# EAGLE design emontx-shield-v1 (EAGLE 6.2)
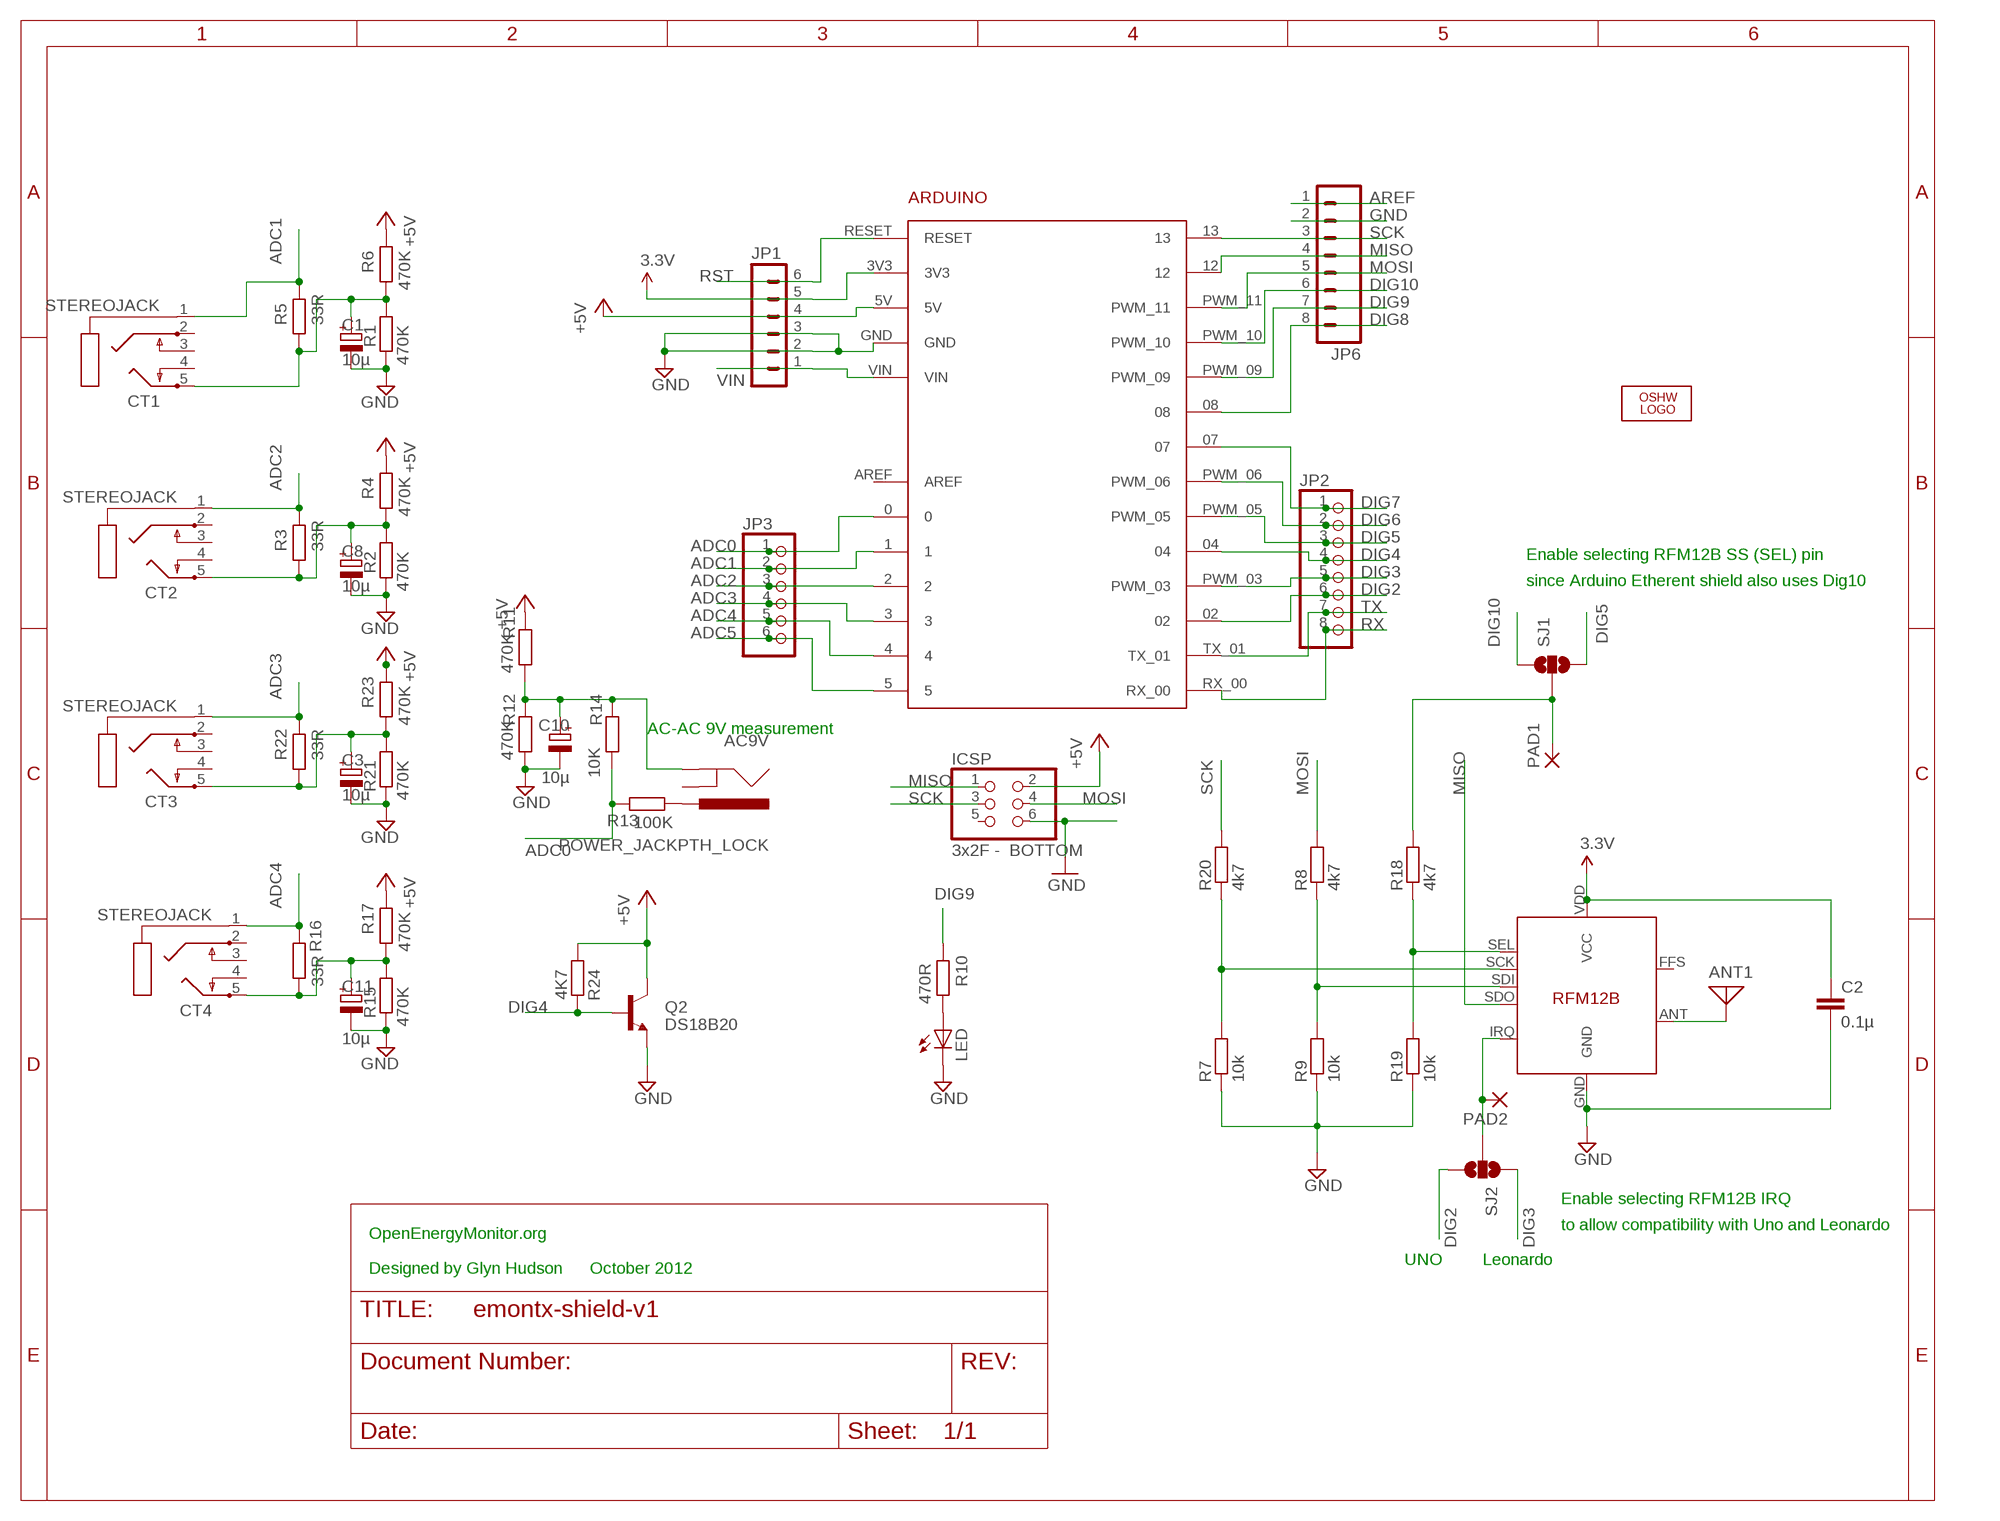
[diagram p0: schematic, sheet 1]

## Parts
AC9V  POWER_JACKPTH_LOCK  [POWER_JACK_PTH_LOCK]
ANT1  ANTENNA  [PAD-01]
ARDUINO1  ARDUINO2  [ARDUINO2]
C1  10µ  CPOL-EUE1.8-4  [E1,8-4]
C2  0.1µ  CAPPTH  [CAP-PTH-SMALL]
C3  10µ  CPOL-EUE1.8-4  [E1,8-4]
C8  10µ  CPOL-EUE1.8-4  [E1,8-4]
C10  10µ  CPOL-EUE1.8-4  [E1,8-4]
C11  10µ  CPOL-EUE1.8-4  [E1,8-4]
CT1  STEREOJACK  [STX3100]
CT2  STEREOJACK  [STX3100]
CT3  STEREOJACK  [STX3100]
CT4  STEREOJACK  [STX3100]
ICSP  3x2F - BOTTOM  PINHD-2X3  [2X03]
JP1  JEELABS_MA06-1  [JEELABS_MA06-1]
JP2  PINHD-1X8  [1X08]
JP3  PINHD-1X6  [1X06]
JP6  SPARKFUN_M08  [SPARKFUN_1X08]
LED  LED3MM  [LED3MM]
LOGO1  OSHW_LOGO_10MILX0200-NT  [OSHW_10X200_NOTEXT]
PAD1  JEELABS_1,6/0,8  [JEELABS_1,6/0,8]
PAD2  JEELABS_1,6/0,8  [JEELABS_1,6/0,8]
Q2  DS18B20  TRANSISTOR_NPNTO92  [TO-92]
R1  470K  R-EU_0204/7  [0204/7]
R2  470K  R-EU_0204/7  [0204/7]
R3  33R  R-EU_0204/7  [0204/7]
R4  470K  R-EU_0204/7  [0204/7]
R5  33R  R-EU_0204/7  [0204/7]
R6  470K  R-EU_0204/7  [0204/7]
R7  10k  RESISTOR_R-EU_0204/7  [RESISTOR_0204/7]
R8  4k7  RESISTOR_R-EU_0204/7  [RESISTOR_0204/7]
R9  10k  RESISTOR_R-EU_0204/7  [RESISTOR_0204/7]
R10  470R  R-EU_0204/7  [0204/7]
R11  470K  R-EU_0204/7  [0204/7]
R12  470K  R-EU_0204/7  [0204/7]
R13  100K  R-EU_0204/7  [0204/7]
R14  10K  R-EU_0204/7  [0204/7]
R15  470K  R-EU_0204/7  [0204/7]
R16  33R  R-EU_0204/7  [0204/7]
R17  470K  R-EU_0204/7  [0204/7]
R18  4k7  RESISTOR_R-EU_0204/7  [RESISTOR_0204/7]
R19  10k  RESISTOR_R-EU_0204/7  [RESISTOR_0204/7]
R20  4k7  RESISTOR_R-EU_0204/7  [RESISTOR_0204/7]
R21  470K  R-EU_0204/7  [0204/7]
R22  33R  R-EU_0204/7  [0204/7]
R23  470K  R-EU_0204/7  [0204/7]
R24  4K7  R-EU_0204/7  [0204/7]
SJ1  SOLDERJUMPER_2WAYS  [SJ_3]
SJ2  SOLDERJUMPER_2WAYS  [SJ_3]
U$2  RFM12B  [RFM12B]

## Nets
3.3V [power]: ARDUINO1.3V3 C2.1 JP1.5 U$2.VDD(VCC)
+5V [power]: ARDUINO1.5V ICSP.2 JP1.4 Q2.3(C) R4.2 R6.2 R11.2 R17.2 R23.2 R24.1
ADC0: ARDUINO1.0 JP3.1 R13.2 R14.1
ADC1: ARDUINO1.1 CT1.1 JP3.2 R5.2
ADC2: ARDUINO1.2 CT2.1 JP3.3 R3.2
ADC3: ARDUINO1.3 CT3.1 JP3.4 R22.2
ADC4: ARDUINO1.4 CT4.1 JP3.5 R16.2
ADC5: ARDUINO1.5 JP3.6
AREF: JP6.1
DIG2: ARDUINO1.02 JP2.6 SJ2.3
DIG3: ARDUINO1.PWM_03 JP2.5 SJ2.1
DIG4: ARDUINO1.04 JP2.4 Q2.2(B) R24.2
DIG5: ARDUINO1.PWM_05 JP2.3 SJ1.3
DIG6: ARDUINO1.PWM_06 JP2.2
DIG7: ARDUINO1.07 JP2.1
DIG8: ARDUINO1.08 JP6.8
DIG9: ARDUINO1.PWM_09 JP6.7 R10.2
DIG10: ARDUINO1.PWM_10 JP6.6 SJ1.1
GND [gnd]: ARDUINO1.GND C1.- C2.2 C3.- C8.- C10.- C11.- ICSP.6 JP1.2 JP1.3 JP6.2 LED.K(C) Q2.1(E) R1.2 R2.2 R7.1 R9.1 R12.1 R15.2 R19.1 R21.2 U$2.GND
MISO: ARDUINO1.12 ICSP.1 JP6.4 U$2.SDO
MOSI: ARDUINO1.PWM_11 ICSP.4 JP6.5 R8.2
N$1: PAD2.1(P) SJ2.2 U$2.IRQ
N$2: PAD1.1(P) R18.2 SJ1.2
N$3: C3.+ CT3.5 R21.1 R22.1 R23.1
N$5: AC9V.PWR R13.1
N$33: C8.+ CT2.5 R2.1 R3.1 R4.1
N$34: AC9V.GND C10.+ R11.1 R12.2 R14.2
N$37: C11.+ CT4.5 R15.1 R16.1 R17.1
N$38: C1.+ CT1.5 R1.1 R5.1 R6.1
N$41: LED.A R10.1
N$42: ANT1.1 U$2.ANT
N$43: R7.2 R20.1 U$2.SCK
N$44: R8.1 R9.2 U$2.SDI
N$45: R18.1 R19.2 U$2.SEL
RST: ARDUINO1.RESET JP1.6
RX: ARDUINO1.RX_00 JP2.8
SCK: ARDUINO1.13 ICSP.3 JP6.3 R20.2
TX: ARDUINO1.TX_01 JP2.7
VIN: ARDUINO1.VIN JP1.1
Unconnected: AC9V.GNDBREAK ARDUINO1.AREF CT1.2 CT1.3 CT1.4 CT2.2 CT2.3 CT2.4 CT3.2 CT3.3 CT3.4 CT4.2 CT4.3 CT4.4 ICSP.5 U$2.FFS

## Notes on the sheet
- Enable selecting RFM12B SS (SEL) pin
- since Arduino Etherent shield also uses Dig10
- AC-AC 9V measurement
- Enable selecting RFM12B IRQ
- to allow compatibility with Uno and Leonardo
- OpenEnergyMonitor.org
- UNO | Leonardo
- Designed by Glyn Hudson      October 2012

## Library data of the parts
AC9V = SparkFun:POWER_JACK: Power Jack This is the standard 5.5mm barrel jack for power. The PTH is the most common, proven, reliable, footprint. All others are experimental. The Slot footprint only works if the mill layer is transmitted to the PCB fab house so be warned. Spark Fun Electronics SKU : PRT-00119. Mating wall wart : TOL-00298 (and others)
ANT1 = discrete:ANTENNA: Antenna
ARDUINO1 = arduino:ARDUINO: For creating Arduino shields
C1 C3 C8 C10 C11 = resistor:CPOL-EU: POLARIZED CAPACITOR, European symbol
C2 = SparkFun:CAP: Capacitor Standard 0603 ceramic capacitor, and 0.1" leaded capacitor.
CT1-CT4 = adafruit:STEREOJACK: MIC/HEADPHONE JACK Stereo jack with two switches. Kycon STX3100, CUI SJ1-3555NG and/or 4UCon 05544
ICSP = pinhead:PINHD-2X3: PIN HEADER
JP1 = jeenodes:JEELABS_MA06-1: PIN HEADER
JP2 = pinhead:PINHD-1X8: PIN HEADER
JP3 = pinhead:PINHD-1X6: PIN HEADER
JP6 = jeenodes:SPARKFUN_M08: Header 8 Standard 8-pin 0.1" header. Use with straight break away headers (SKU : PRT-00116), right angle break away headers (PRT-00553), swiss pins (PRT-00743), machine pins (PRT-00117), and female headers (PRT-00115).
LED = adafruit:LED: LED OSRAM: - CHIPLED LG R971, LG N971, LY N971, LG Q971, LY Q971, LO R971, LY R971 LH N974, LH R974 LS Q976, LO Q976, LY Q976 LO Q996 - Hyper CHIPLED LW Q18S LB Q993, LB Q99A, LB R99A - SideLED LS A670, LO A670, LY A670, LG A670, LP A670 LB A673, LV A673, LT A673, LW A673 LH A674 LY A675 LS A676, LA A676, LO A676, LY A676, LW A676 LS A679, LY A679, LG A679 - Hyper Micro SIDELED® LS Y876, LA Y876, LO Y876, LY Y876 LT Y87S - SmartLED LW L88C, LW L88S LB L89C, LB L89S, LG L890 LS L89K, LO L89K, LY L89K LS L896, LA L896, LO L896, LY L896 - TOPLED LS T670, LO T670, LY T670, LG T670, LP T670 LSG T670, LSP T670, LSY T670, LOP T670, LYG T670 LG T671, LOG T671, LSG T671 LB T673, LV T673, LT T673, LW T673 LH T674 LS T676, LA T676, LO T676, LY T676, LB T676, LH T676, LSB T676, LW T676 LB T67C, LV T67C, LT T67C, LS T67K, LO T67K, LY T67K, LW E67C LS E67B, LA E67B, LO E67B, LY E67B, LB E67C, LV E67C, LT E67C LW T67C LS T679, LY T679, LG T679 LS T770, LO T770, LY T770, LG T770, LP T770 LB T773, LV T773, LT T773, LW T773 LH T774 LS E675, LA E675, LY E675, LS T675 LS T776, LA T776, LO T776, LY T776, LB T776 LHGB T686 LT T68C, LB T68C - Hyper Mini TOPLED® LB M676 - Mini TOPLED Santana® LG M470 LS M47K, LO M47K, LY M47K Source: http://www.osram.convergy.de/
LOGO1 = ohw-logo:OSHW_LOGO_10MIL
PAD1 PAD2 = jeenodes:JEELABS_1,6/0,8: THROUGH-HOLE PAD
Q2 = SparkFun:TRANSISTOR_NPN: Transistor NPN BJT configuration in SOT23 package. MMBT2222 is the common NPN we use. Double check BCE configuration again layout.
R1-R6 R10-R17 R21-R24 = rcl:R-EU_: RESISTOR, European symbol
R7-R9 R18-R20 = jeenodes:RESISTOR_R-EU_: RESISTOR, European symbol
SJ1 SJ2 = SparkFun:SOLDERJUMPER_2WAY: Solder Jumper 2 way solder jumper
U$2 = lh-library:RFM12B

## Net classes
0 default: width 0.203 mm, drill 0.6 mm, clearance 0.203 mm
1 power: width 0.305 mm, drill 0.6 mm, clearance 0.254 mm
2 gnd: width 0.254 mm, drill 0.6 mm, clearance 0.254 mm

## Board
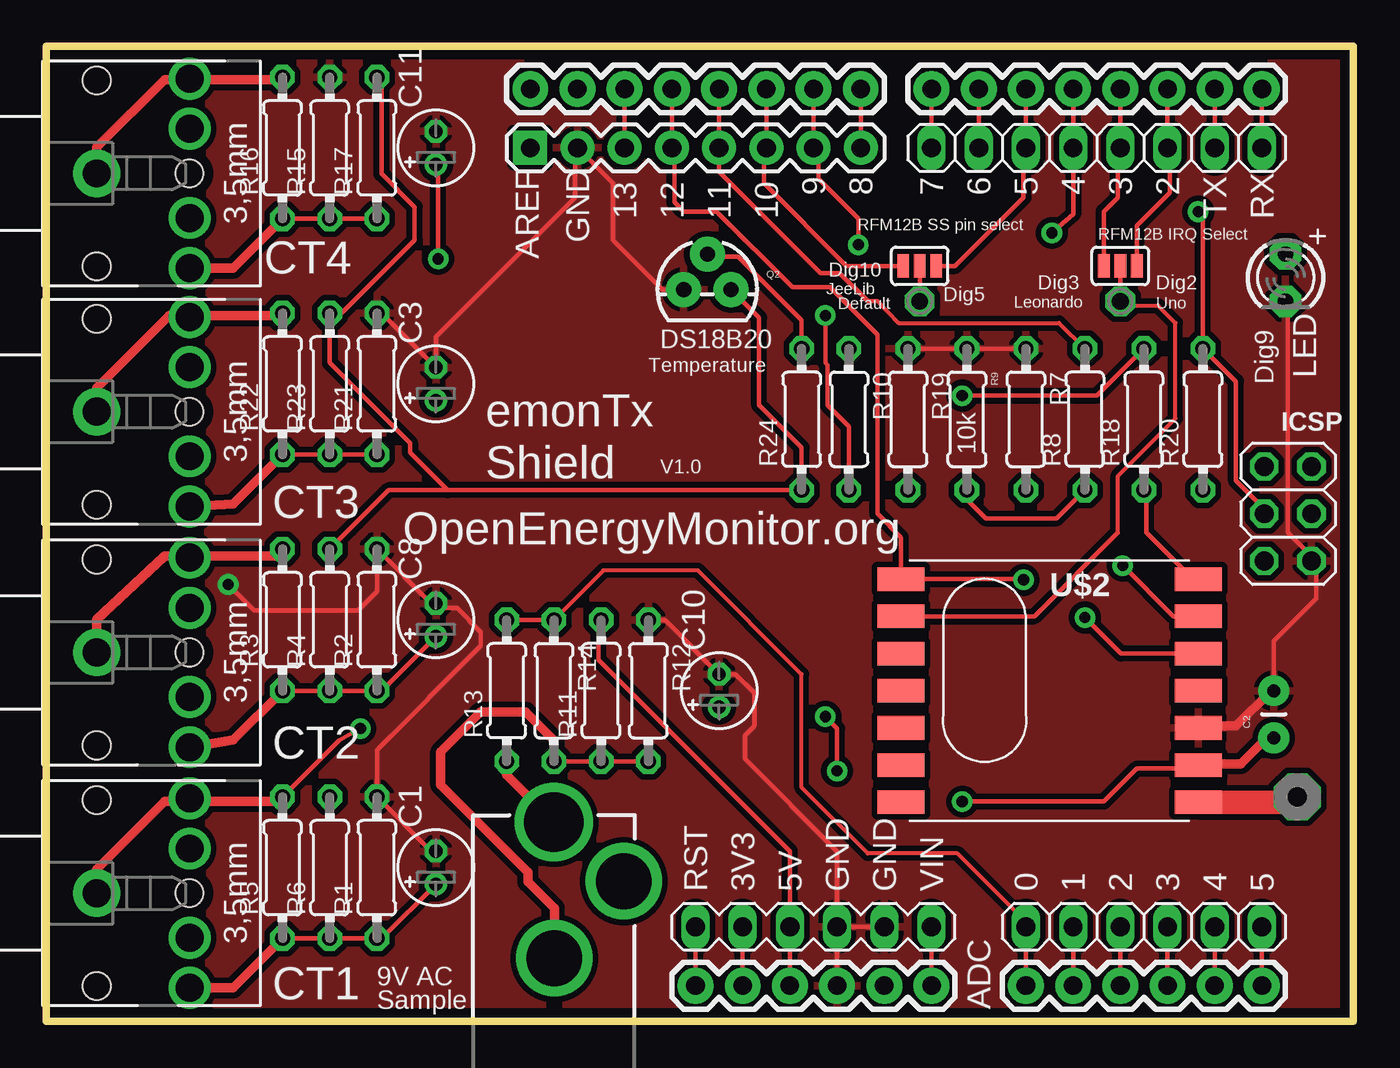
[diagram p1: board, top side]
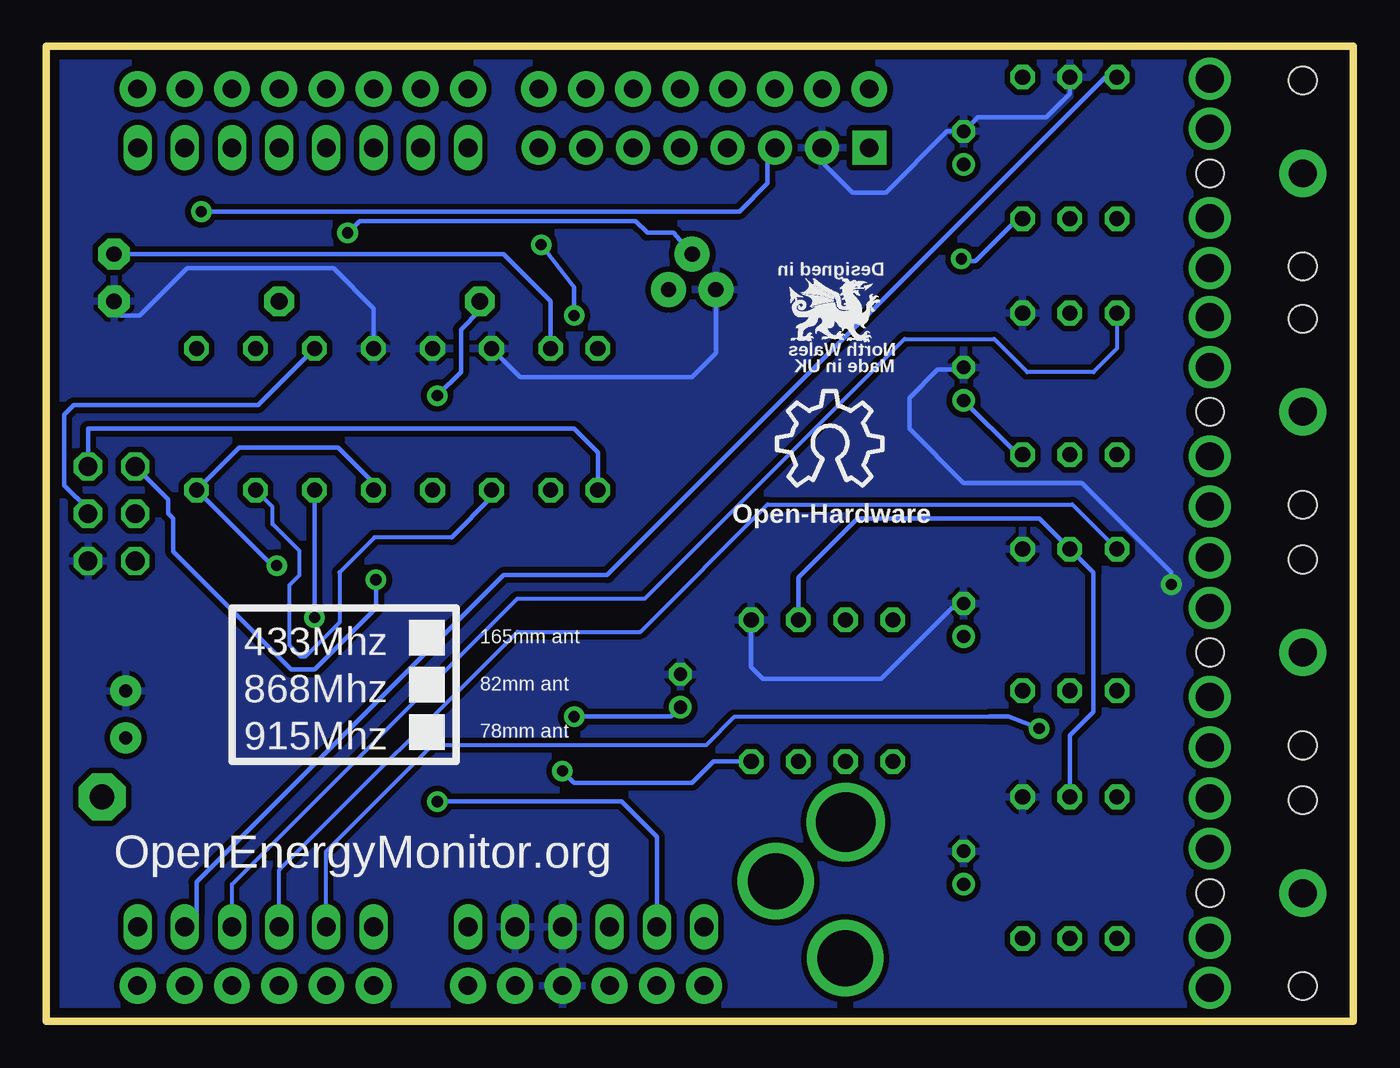
[diagram p2: board, bottom side, seen from below]

Size 70.31 x 52.45 mm. Coordinates in mm from the lower left corner, seen from the top.
Outline: 0,0 70.31,0 70.31,52.45 0,52.45 0,0
Copper layers (1*16): Top 0.035mm / dielectric 1.5mm / Bottom 0.035mm
Design rules: minimum track width 8mil, minimum drill 0.6mm, track to track 8mil, track to pad 10mil, pad to pad 10mil, via to via 10mil, smd to smd 10mil, copper to edge 20mil, drill to drill 16mil, minimum pad ring 10mil, minimum via ring 10mil, stop-mask expansion 0.075mm, vias tented up to drill 0.6mm, thermal gap 10mil

### Footprints (pad centres in the part's own frame; a part is rotated, then mirrored left to right if it is on the bottom)
POWER_JACK_PTH_LOCK = drill 2.997 pad 4.115: GND 0.025,6.557; GNDBREAK 3.762,10.7 | drill 3.2 pad 4.115: PWR 0,13.878
PAD-01 = drill 1.321 pad 2.54 octagon: 1 0,0
ARDUINO2 = drill 1 pad 1.93: 0 0,12.7; 1 0,10.16; 2 0,7.62; 02 48.26,5.08; 3 0,5.08; 3V3 0,27.94; 4 0,2.54; 04 48.26,10.16; 5 0,0; 5V 0,25.4; 07 48.26,17.78; 08 48.26,21.59; 12 48.26,31.75; 13 48.26,34.29; AREF 48.26,39.37; GND 0,22.86; GND1 0,20.32; GND2 48.26,36.83; PWM_03 48.26,7.62; PWM_05 48.26,12.7; PWM_06 48.26,15.24; PWM_09 48.26,24.13; PWM_10 48.26,26.67; PWM_11 48.26,29.21; RESET 0,30.48; RX_00 48.26,0; TX_01 48.26,2.54; VIN 0,17.78
E1,8-4 = drill 0.711 pad 1.168: + -0.889,0 | drill 0.711 pad 1.168 octagon: - 0.889,0
CAP-PTH-SMALL = drill 0.7 pad 1.651: 1 0,0; 2 2.54,0
STX3100 = drill 1.5 pad 2.54: 1 2.7,-0.1 | drill 1.5: 2 7.7,5; 3 7.7,2.3; 4 7.7,-2.5; 5 7.7,-5.2 | hole 1.5: 2.7,4.9; 2.7,-5.1; 7.7,-0.1
2X03 = drill 1.016 octagon: 1 -2.54,-1.27; 2 -2.54,1.27; 3 0,-1.27; 4 0,1.27; 5 2.54,-1.27; 6 2.54,1.27
JEELABS_MA06-1 = drill 1.016 long: 1 0,0; 2 2.54,0; 3 5.08,0; 4 7.62,0; 5 10.16,0; 6 12.7,0
1X08 = drill 1.016 long: 1 -8.89,0; 2 -6.35,0; 3 -3.81,0; 4 -1.27,0; 5 1.27,0; 6 3.81,0; 7 6.35,0; 8 8.89,0
1X06 = drill 1.016 long: 1 -6.35,0; 2 -3.81,0; 3 -1.27,0; 4 1.27,0; 5 3.81,0; 6 6.35,0
SPARKFUN_1X08 = drill 1.016 pad 1.829 square: 1 0,0 | drill 1.016 pad 1.829: 2 2.54,0; 3 5.08,0; 4 7.62,0; 5 10.16,0; 6 12.7,0; 7 15.24,0; 8 17.78,0
LED3MM = drill 0.813 pad 1.676 octagon: A -1.27,0; K 1.27,0
JEELABS_1,6/0,8 = drill 0.9 pad 1.6 octagon: 1 0,0
TO-92 = drill 0.813 pad 1.88: 1 -1.27,0; 2 0,1.905; 3 1.27,0
0204/7 = drill 0.813 octagon: 1 -3.81,0; 2 3.81,0
RESISTOR_0204/7 = drill 0.813 octagon: 1 -3.81,0; 2 3.81,0
SJ_3 = smd 0.635 x 1.27: 1 -0.889,0; 2 0,0; 3 0.889,0
RFM12B = smd 2.54 x 1.27: ANT 8,-6; FFS -8,2; GND 8,-2; IRQ -8,4; P$8 -8,0; P$9 -8,-2; P$10 -8,-4; P$12 -8,-6; P$16 8,0; SCK 8,4; SDI 8,2; SDO -8,6; SEL 8,6; VDD 8,-4

### Placement (x,y rotation side)
AC9V  27.3,-3.17 0 top
ANT1  67.31,12.06 0 top
ARDUINO1  65.41,1.91 90 top
C1  20.95,8.26 90 top
C2  66.04,15.24 90 top
C3  20.95,34.29 90 top
C8  20.95,21.59 90 top
C10  36.2,17.78 90 top
C11  20.95,46.99 90 top
CT1  0,6.99 0 top
CT2  0,19.94 0 top
CT3  0,32.89 0 top
CT4  0,45.72 0 top
ICSP  66.8,27.3 270 top
JP1  47.62,5.08 180 top
JP2  56.52,46.99 0 top
JP3  59.05,5.08 0 top
JP6  26.04,46.99 0 top
LED  66.67,40.01 270 top
LOGO1  30.99,28.83 0 bottom
PAD1  46.99,38.73 0 top
PAD2  57.78,38.73 0 top
Q2  35.56,39.37 0 top
R1  17.78,8.26 90 top
R2  17.78,21.59 90 top
R3  12.7,21.59 90 top
R4  15.24,21.59 90 top
R5  12.7,8.26 90 top
R6  15.24,8.26 90 top
R7  52.7,32.39 270 top
R8  55.88,32.39 90 top
R9  49.53,32.39 270 top
R10  43.18,32.39 270 top
R11  29.84,17.78 90 top
R12  32.38,17.78 270 top
R13  24.77,17.78 90 top
R14  27.3,17.78 270 top
R15  15.24,46.99 90 top
R16  12.7,46.99 90 top
R17  17.78,46.99 90 top
R18  59.05,32.39 90 top
R19  46.35,32.39 270 top
R20  62.23,32.39 90 top
R21  17.78,34.29 90 top
R22  12.7,34.29 90 top
R23  15.24,34.29 90 top
R24  40.64,32.39 90 top
SJ1  46.99,40.64 0 top
SJ2  57.78,40.64 0 top
U$2  53.98,17.78 0 top

### Tracks (layer width: path | path; a pad name or v marks a point on that pad's centre or on a via)
3.3V  (via drill 0.6)
  Top 0.254: v49.28,11.81 56.9,11.81 58.67,13.59 62.23,13.59 62.48,13.84 | ARDUINO1.3V3 JP1.5
  Top 0.508: C2.1 65.66,15.24 64.26,13.84 62.48,13.84 62.04,13.84 U$2.VDD
  Bottom 0.254: JP1.5 37.47,9.91 39.37,11.81 v49.28,11.81
+5V
  Top 0.254: R11.2 29.72,21.46 29.72,19.43 40.01,9.14 JP1.4 ARDUINO1.5V | 21.59,28.57 R24.1 40.64,30.86 38.35,33.15 38.35,37.85 Q2.3 | 21.59,28.57 18.41,28.57 R4.2 | 21.59,28.57 19.56,30.61 19.56,31.11 15.24,35.43 R23.2 15.88,38.1 19.81,42.04 19.81,43.82 18.03,45.59 18.03,50.55 R17.2
  Bottom 0.254: R11.2 29.84,23.88 26.67,27.05 16.89,27.05 R4.2 13.97,24.13 13.97,16.64 15.24,15.37 R6.2 | ICSP.2 68.07,31.88 41.91,31.88 40.64,30.61 R24.1
ADC0
  Top 0.203: JP3.1 52.7,5.33 49.02,9.02 44.2,9.02 40.64,12.57 40.64,18.67 35.05,24.26 29.97,24.26 R14.1
  Top 0.254: ARDUINO1.0 JP3.1 | R13.2 R14.1
ADC1  (via drill 0.6)
  Top 0.254: ARDUINO1.1 JP3.2 | v16.89,15.75 15.75,15.11 R5.2
  Top 0.508: CT1.1 2.7,8.16 6.35,11.81 12.45,11.81 R5.2
  Bottom 0.203: JP3.2 55.24,9.14 49.53,14.86 34.8,14.86 33.27,16.38 19.56,16.38
  Bottom 0.254: 19.56,16.38 18.54,16.38 v16.89,15.75
ADC2
  Top 0.254: ARDUINO1.2 JP3.3
  Top 0.508: CT2.1 2.7,21.62 6.35,25.02 12.57,25.02 R3.2
  Bottom 0.203: JP3.3 57.78,8.13 44.96,20.95 38.35,20.95 31.5,27.81 15.11,27.81 R3.2
ADC3
  Top 0.254: ARDUINO1.3 JP3.4
  Top 0.508: CT3.1 2.7,34.07 6.6,37.97 12.57,37.97 R22.2
  Bottom 0.203: JP3.4 60.33,7.37 44.96,22.73 38.1,22.73 24.13,36.7 19.3,36.7 17.53,34.93 13.97,34.93 12.7,36.2 R22.2
ADC4
  Top 0.254: ARDUINO1.4 JP3.5
  Top 0.508: CT4.1 2.7,47.02 6.35,50.67 12.57,50.67 R16.2
  Bottom 0.254: R16.2 13.34,50.8 40.13,24 45.72,24 62.23,7.49 62.23,5.71 JP3.5
ADC5
  Top 0.254: ARDUINO1.5 JP3.6
DIG2
  Top 0.254: SJ2.3 58.67,42.8 60.45,44.58 60.45,46.86 JP2.6 ARDUINO1.02
DIG3
  Top 0.254: SJ2.1 56.9,43.56 57.66,44.32 57.66,46.86 JP2.5 ARDUINO1.PWM_03
DIG4  (via drill 0.6)
  Top 0.254: R24.2 40.64,37.72 37.21,41.15 35.69,41.15 Q2.2 | v54.1,42.42 55.24,43.43 JP2.4 ARDUINO1.04
  Bottom 0.254: Q2.2 36.58,42.42 37.97,42.42 38.61,43.05 53.47,43.05 v54.1,42.42
DIG5
  Top 0.254: SJ1.3 48.9,40.64 52.58,44.32 52.58,46.86 JP2.3 ARDUINO1.PWM_05
DIG6
  Top 0.254: JP2.2 ARDUINO1.PWM_06
DIG7
  Top 0.254: JP2.1 ARDUINO1.07
DIG8
  Top 0.254: JP6.8 ARDUINO1.08
DIG9  (via drill 0.6)
  Top 0.254: R10.2 43.18,32 42.04,33.15 42.04,35.31 41.91,35.43 v41.91,37.97 | v43.69,41.78 43.69,43.18 41.53,45.34 41.53,46.74 JP6.7 ARDUINO1.PWM_09
  Bottom 0.254: v41.91,37.97 41.91,39.5 v43.69,41.78
DIG10
  Top 0.254: SJ1.1 43.05,40.64 38.61,45.09 38.61,46.86 JP6.6 ARDUINO1.PWM_10
GND  (via drill 0.6)
  Top 0.254: R12.1 33.27,21.59 C10.- 37.08,18.67 38.1,17.65 38.1,15.88 37.59,15.37 37.59,14.1 42.55,9.14 JP1.3 | C1.- 20.7,9.14 R1.2 17.78,14.61 23.37,20.19 23.37,20.95 22.1,22.22 21.21,22.22 C8.- 20.7,22.48 R2.2 17.78,23.11 16.76,22.1 11.18,22.1 v9.78,23.49 | R21.2 18.03,38.1 C3.- 20.95,36.83 28.45,44.32 28.45,46.86 JP6.2 30.48,45.09 30.48,42.04 33.15,39.37 Q2.1 | C2.2 66.04,20.45 68.33,22.73 68.33,24.51 ICSP.6 68.07,25.02 66.8,26.29 66.8,38.61 LED.K | R19.1 R9.1 R7.1 | ARDUINO1.GND JP1.3 | JP1.3 JP1.2
  Top 0.508: C2.2 65.91,17.78 64.01,15.88 62.07,15.88 U$2.GND
  Bottom 0.254: R12.1 32.38,19.05 31.75,18.41 25.4,18.41 21.59,22.22 21.21,22.22 C8.- | R15.2 15.24,49.91 16.51,48.64 20.19,48.64 C11.- 21.84,47.88 25.15,44.58 26.92,44.58 28.45,46.1 28.45,46.86 JP6.2 | Q2.1 34.29,35.94 35.56,34.67 44.83,34.67 R19.1 | R7.1 52.7,38.35 54.86,40.51 62.74,40.51 65.28,37.97 66.55,37.97 66.8,38.23 66.8,38.61 LED.K | v9.78,23.49 9.78,24.13 14.61,28.96 20.95,28.96 23.88,31.88 23.88,33.53 22.35,35.05 21.08,35.05 C3.-
  pour Bottom (isolate 0.305): -3.58,54.71 73.91,54.71 73.91,-3.58 -3.35,-3.58 -3.35,54.66
  pour Top (isolate 0.305): -5.26,56.26 76.56,56.26 76.56,-3.28 -5.18,-3.28 -5.18,56.21
MISO  (via drill 0.6)
  Top 0.254: v52.58,23.75 52.55,23.78 U$2.SDO 45.98,26.03 44.7,27.3 44.7,36.96 42.16,39.5 40.13,39.5 36.07,43.56 34.29,43.56 33.78,44.07 33.78,46.86 JP6.4 ARDUINO1.12
  Bottom 0.254: v52.58,23.75 52.58,22.22 55.88,18.92 57.15,18.92 63.5,25.27 63.5,27.05 63.75,27.3 63.75,28.07 ICSP.1
MOSI
  Top 0.203: 44.7,38.73 45.85,37.57 54.48,37.57 R8.2
  Top 0.254: 44.7,38.73 44.2,38.73 42.67,40.26 41.66,40.26 36.2,45.72 JP6.5 ARDUINO1.PWM_11
  Bottom 0.254: ICSP.4 68.07,27.56 69.34,28.83 69.34,32.64 68.83,33.15 58.93,33.15 R8.2
N$1
  Top 0.203: 57.66,26.29 57.66,29.34 60.76,32.44 60.76,37.57 59.84,38.48 58.04,38.48 PAD2.1
  Top 0.254: U$2.IRQ 53.15,21.78 57.66,26.29 | SJ2.2 PAD2.1
N$2  (via drill 0.6)
  Top 0.254: SJ1.2 PAD1.1 | v49.28,33.66 56.52,33.66 R18.2
  Bottom 0.254: v49.28,33.66 48.01,34.93 48.01,37.21 46.99,38.23 PAD1.1
N$3
  Top 0.254: R22.1 R23.1 R21.1
  Top 0.508: CT3.5 10.04,27.82 R22.1
  Bottom 0.254: R21.1 18.03,30.48 C3.+
N$5
  Top 0.508: R13.1 24.77,13.24 AC9V.PWR
N$33
  Top 0.254: R3.1 R4.1 R2.1 18.03,17.78 C8.+
  Top 0.508: CT2.5 10.04,15.12 R3.1
N$34  (via drill 0.6)
  Top 0.254: R14.2 R11.1 R12.2 | v42.55,13.46 42.55,15.75 v41.91,16.38
  Top 0.508: AC9V.GND 27.33,6.07 25.91,7.49 25.91,8 21.21,12.7 21.21,14.48 23.37,16.64 25.78,16.64 27.3,15.11 R14.2
  Bottom 0.254: R12.2 34.42,13.97 35.56,12.83 41.91,12.83 v42.55,13.46 | v41.91,16.38 36.7,16.38 C10.+
N$37  (via drill 0.6)
  Top 0.254: R16.1 R15.1 R17.1 | v21.08,41.02 21.08,45.97 C11.+
  Top 0.508: CT4.5 10.04,40.52 R16.1
  Bottom 0.254: R17.1 18.03,43.18 20.32,40.89 20.95,40.89 v21.08,41.02
N$38
  Top 0.254: R5.1 R6.1 R1.1 18.03,4.45 C1.+
  Top 0.508: CT1.5 10.04,1.78 R5.1
N$41
  Bottom 0.254: LED.A 45.72,41.27 43.18,38.73 R10.1
N$42
  Top 1.27: U$2.ANT 67.03,11.78 ANT1.1
N$43  (via drill 0.6)
  Top 0.254: U$2.SCK 60.64,21.78 v57.91,24.51
  Bottom 0.254: v57.91,24.51 58.17,24.51 R20.1 59.94,30.86 54.61,30.86 52.7,28.96 R7.2
N$44  (via drill 0.6)
  Top 0.254: U$2.SDI 57.82,19.78 v55.88,21.72 | R9.2 49.53,28.07 50.55,27.05 54.36,27.05 R8.1
  Bottom 0.254: v55.88,21.72 R8.1
N$45
  Top 0.254: U$2.SEL 61.69,23.78 59.18,26.29 59.18,28.45 R18.1
  Bottom 0.203: 48.51,26.04 52.65,26.04 54.53,24.15 54.53,21.46 56.39,19.61 56.62,19.61 57.23,20.22 57.23,23.47 56.69,24 56.69,25.3 58.14,26.75 58.14,27.66 R18.1
  Bottom 0.254: R19.2 46.35,28.19 48.51,26.04
RST
  Top 0.254: ARDUINO1.RESET JP1.6
RX
  Top 0.254: JP2.8 ARDUINO1.RX_00
SCK  (via drill 0.6)
  Top 0.254: ICSP.3 65.53,27.56 64.01,29.08 64.01,34.42 R20.2 62.23,43.31 v61.98,43.56 | JP6.3 ARDUINO1.13
  Bottom 0.254: v61.98,43.56 33.02,43.56 31.5,45.09 31.5,46.61 JP6.3
TX
  Top 0.254: JP2.7 ARDUINO1.TX_01
VIN
  Top 0.254: ARDUINO1.VIN 47.62,4.83 JP1.1 47.62,5.21 48.13,5.71

### Text on the board
tSilk: 9 | 8 | 7 | 6 | 5 | 4 | 3 | 2 | 13 | 12 | 11 | 10 | RFM12B SS pin select | TX | RX | GND | RFM12B IRQ Select | AREF | Dig10 | JeeLib | Dig3 | Dig2 | Default | Dig5 | Leonardo | Uno | Temperature | Dig9 | emonTx | Shield | V1.0 | OpenEnergyMonitor.org | RST | 3V3 | 5V | GND | GND | VIN | 0 | 1 | 2 | 3 | 4 | 5 | 9V AC | Sample | ADC
_tsilk: Designed in | North Wales | Made in UK
_bsilk: 165mm ant | 433Mhz | 165mm ant | 165mm ant | 433Mhz | 433Mhz | 868Mhz | 82mm ant | 82mm ant | 82mm ant | 868Mhz | 868Mhz | 78mm ant | 915Mhz | 78mm ant | 915Mhz | 78mm ant | 915Mhz | 165mm ant | 433Mhz | 82mm ant | 868Mhz | 78mm ant | 915Mhz
_bNames: Designed in | North Wales | Made in UK | Open-Hardware | 165mm ant | 433Mhz | 82mm ant | 868Mhz | 78mm ant | 915Mhz | OpenEnergyMonitor.org